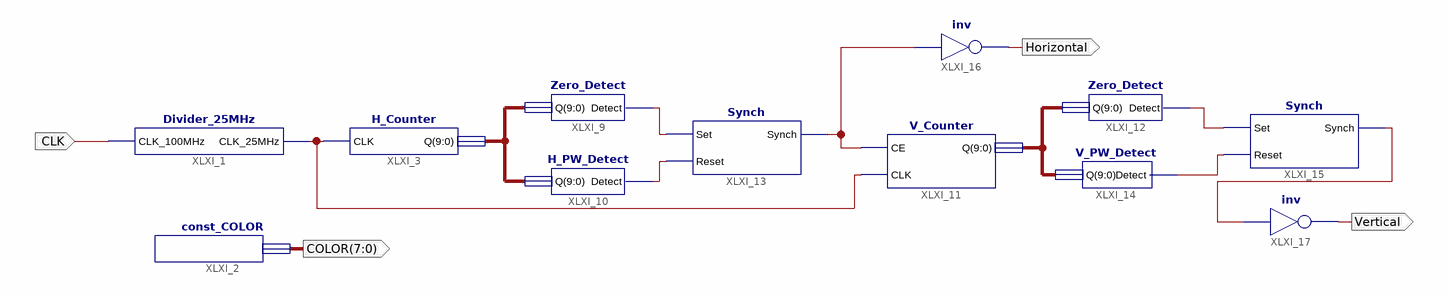
[diagram p0: schematic sheet 1]
// Xilinx ISE schematic VGA_Oscillator.sch (spartan6) as structural Verilog: 12 symbols, 4 ports
module VGA_Oscillator (
  input  CLK,
  output Vertical,
  output Horizontal,
  output [7:0] COLOR
);

  wire XLXN_17, XLXN_20, XLXN_21, XLXN_27, XLXN_31, XLXN_33, XLXN_35;
  wire [9:0] XLXN_23, XLXN_30;

  Divider_25MHz XLXI_1 (.CLK_100MHz(CLK), .CLK_25MHz(XLXN_17));
  const_COLOR XLXI_2 (.COLOR(COLOR));
  H_Counter XLXI_3 (.CLK(XLXN_17), .Q(XLXN_23));
  Zero_Detect XLXI_9 (.Q(XLXN_23), .Detect(XLXN_20));
  H_PW_Detect XLXI_10 (.Q(XLXN_23), .Detect(XLXN_21));
  V_Counter XLXI_11 (.CE(XLXN_27), .CLK(XLXN_17), .Q(XLXN_30));
  Zero_Detect XLXI_12 (.Q(XLXN_30), .Detect(XLXN_31));
  Synch XLXI_13 (.Set(XLXN_20), .Reset(XLXN_21), .Synch(XLXN_27));
  V_PW_Detect XLXI_14 (.Q(XLXN_30), .Detect(XLXN_33));
  Synch XLXI_15 (.Set(XLXN_31), .Reset(XLXN_33), .Synch(XLXN_35));
  not XLXI_17 (Vertical, XLXN_35);
  not XLXI_16 (Horizontal, XLXN_27);
endmodule
